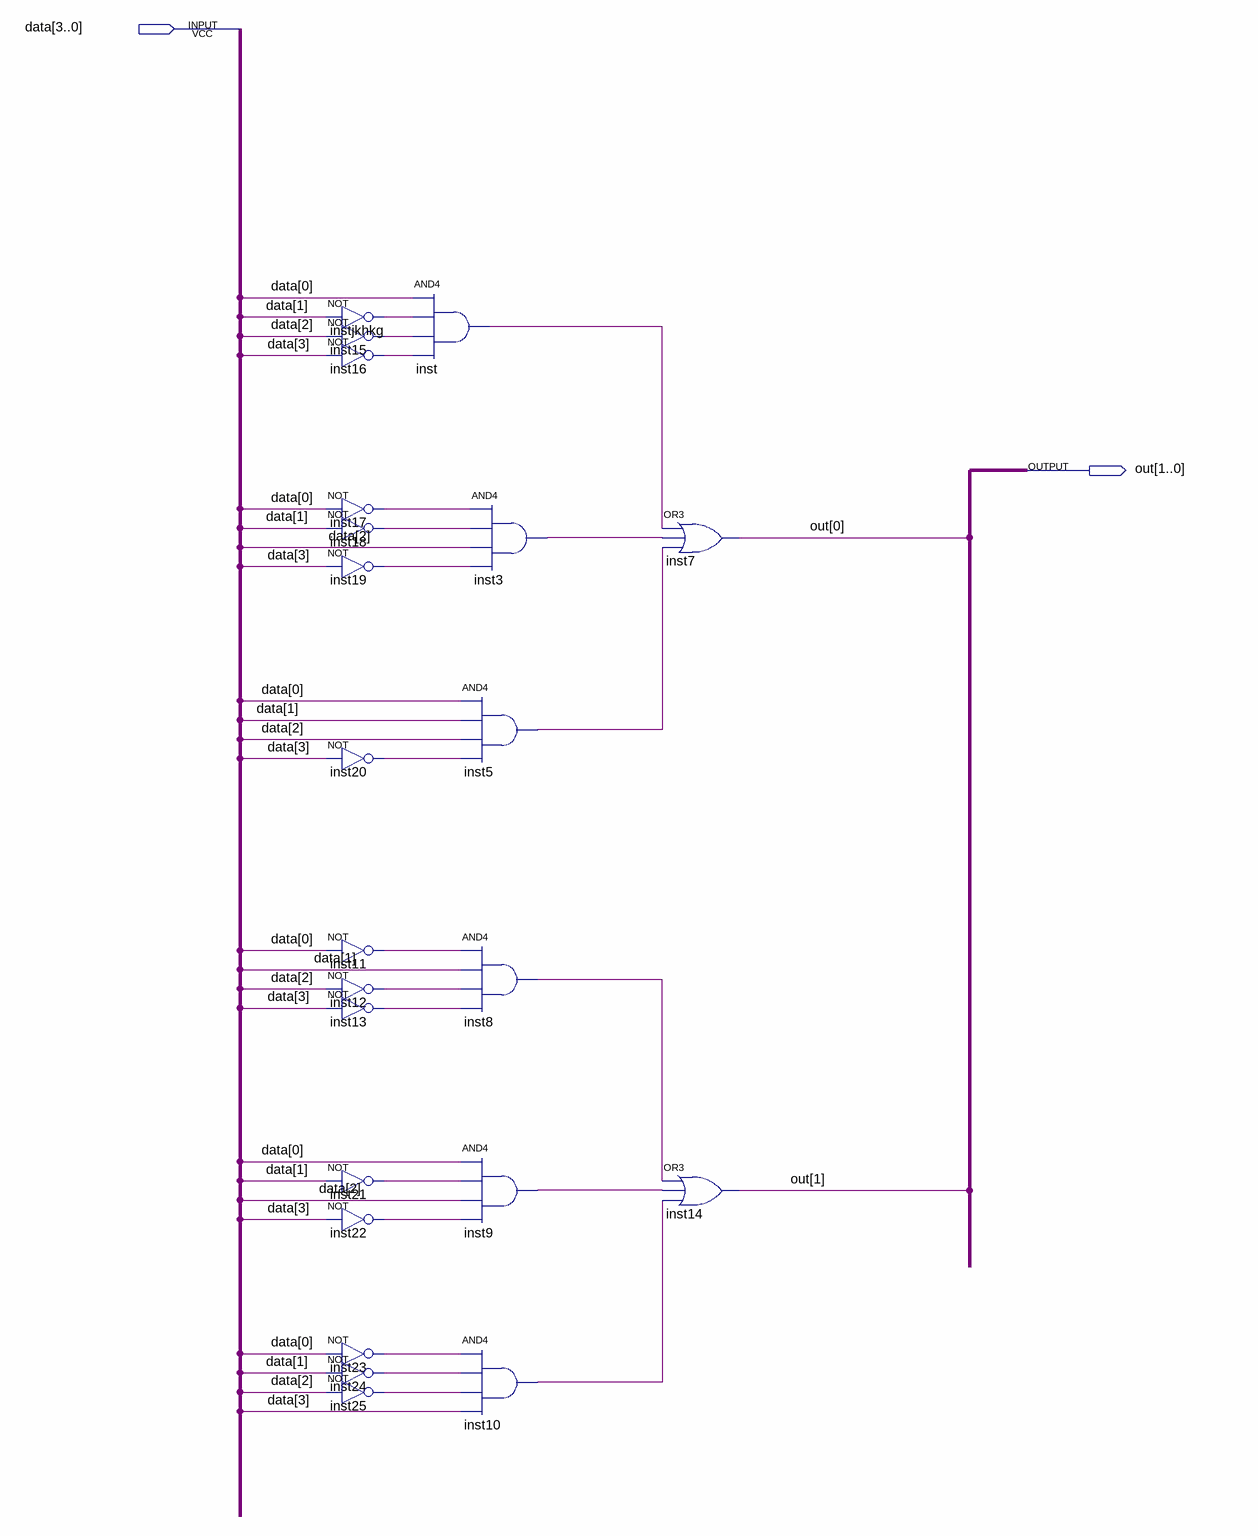
[diagram p0: schematic sheet]
// Quartus schematic mod3.bdf as structural Verilog: 23 symbols, 2 pins
module mod3 (
  input  [3:0] data,
  output [1:0] out
);

  wire inst3_out, inst5_out, inst8_out, inst9_out, inst10_out, inst11_out, inst12_out, inst13_out,
       inst15_out, inst16_out, inst17_out, inst18_out, inst19_out, inst20_out, inst21_out, inst22_out,
       inst23_out, inst24_out, inst25_out, inst_out, instjkhkg_out;

  not instjkhkg (instjkhkg_out, data[1]);
  not inst15 (inst15_out, data[2]);
  not inst16 (inst16_out, data[3]);
  not inst17 (inst17_out, data[0]);
  not inst18 (inst18_out, data[1]);
  not inst19 (inst19_out, data[3]);
  not inst20 (inst20_out, data[3]);
  not inst11 (inst11_out, data[0]);
  not inst12 (inst12_out, data[2]);
  not inst13 (inst13_out, data[3]);
  not inst21 (inst21_out, data[1]);
  not inst22 (inst22_out, data[3]);
  not inst23 (inst23_out, data[0]);
  not inst24 (inst24_out, data[1]);
  not inst25 (inst25_out, data[2]);
  and inst (inst_out, data[0], instjkhkg_out, inst15_out, inst16_out);
  and inst3 (inst3_out, inst17_out, inst18_out, data[2], inst19_out);
  and inst5 (inst5_out, data[0], data[1], data[2], inst20_out);
  and inst8 (inst8_out, inst11_out, data[1], inst12_out, inst13_out);
  and inst9 (inst9_out, data[0], inst21_out, data[2], inst22_out);
  and inst10 (inst10_out, inst23_out, inst24_out, inst25_out, data[3]);
  or inst7 (out[0], inst_out, inst3_out, inst5_out);
  or inst14 (out[1], inst8_out, inst9_out, inst10_out);
endmodule
